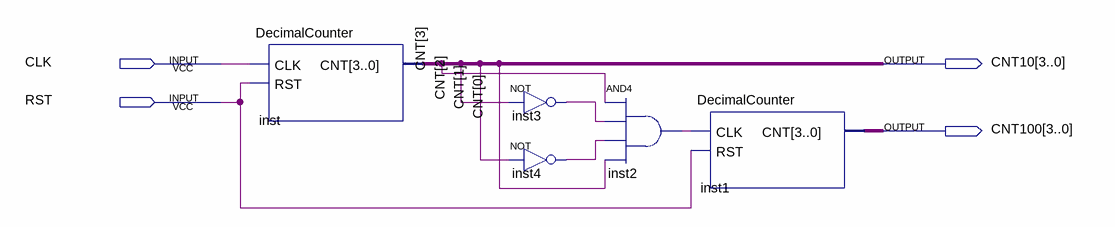
[diagram p0: schematic sheet]
// Quartus schematic HundredCounter.bdf as structural Verilog: 5 symbols, 4 pins
module HundredCounter (
  input  CLK,
  input  RST,
  output [3:0] CNT10,
  output [3:0] CNT100
);

  wire inst2_out, inst3_out, inst4_out;

  DecimalCounter inst (.CLK(CLK), .RST(RST), .CNT(CNT10));
  not inst3 (inst3_out, CNT10[2]);
  not inst4 (inst4_out, CNT10[1]);
  and inst2 (inst2_out, CNT10[3], inst3_out, inst4_out, CNT10[0]);
  DecimalCounter inst1 (.CLK(inst2_out), .RST(RST), .CNT(CNT100));

  // Other names for the same wires on the sheet: CNT[3:0] = CNT10
endmodule
